# Altium schematic sheet RS485Click.SchDoc
size A
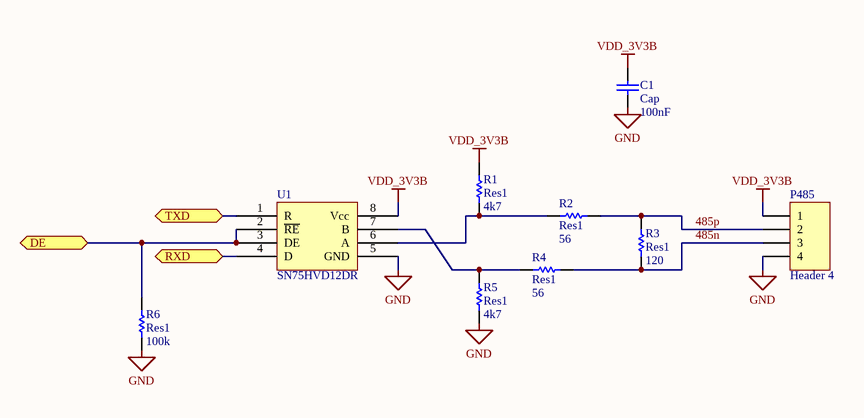
[diagram p0: RS485Click.SchDoc]

## Parts
C1  Cap  value 100nF  [RAD-0.3]
P485  Header 4  [HDR1X4]
R1  Res1  value 4k7  [AXIAL-0.3]
R2  Res1  value 56  [AXIAL-0.3]
R3  Res1  value 120  [AXIAL-0.3]
R4  Res1  value 56  [AXIAL-0.3]
R5  Res1  value 4k7  [AXIAL-0.3]
R6  Res1  value 100k  [AXIAL-0.3]
U1  SN75HVD12DR  [SOIC127P599X175-8N]

## Ports
DE, RXD, TXD

## Nets
GND: C1.1 P485.4 R5.2 R6.2 U1.5(GND)
VDD_3V3B: C1.2 P485.1 R1.1 U1.8(Vcc)
485n: P485.3 R3.1 R4.1
485p: P485.2 R2.1 R3.2
DE: R6.1 U1.2(~{RE}) U1.3(DE) ; port DE
RXD: U1.4(D) ; port RXD
TXD: U1.1(R) ; port TXD
NetR1_2: R1.2 R2.2 U1.6(A)
NetR4_2: R4.2 R5.1 U1.7(B)

## Library data of the parts
C1 = Cap: Capacitor; Published: 8-Jun-2000; LatestRevisionDate: 17-Jul-2002; LatestRevisionNote: Re-released for DXP Platform.; PackageReference: RAD-0.3; Publisher: Altium Limited; PackageDescription: Radial Cap, Thru-Hole; 2 Leads; 0.3 in Pin Spacing
P485 = Header 4: Header, 4-Pin; LatestRevisionDate: 17-Jul-2002; LatestRevisionNote: Re-released for DXP Platform.; Publisher: Altium Limited
R1-R6 = Res1: Resistor; Published: 8-Jun-2000; LatestRevisionDate: 17-Jul-2002; LatestRevisionNote: Re-released for DXP Platform.; PackageReference: AXIAL-0.3; Publisher: Altium Limited; PackageDescription: Axial Device, Thru-Hole; 2 Leads; 0.3 in Pin Spacing
U1 = SN75HVD12DR: Vendor Part Number: 296-26658-1-ND; Vendor: Digikey; Manufacturer Part Number: SN75HVD12DR